# EasyEDA Pro project ProPrj_1300风扇_2024-07-27.epro

# Schematic Schematic1
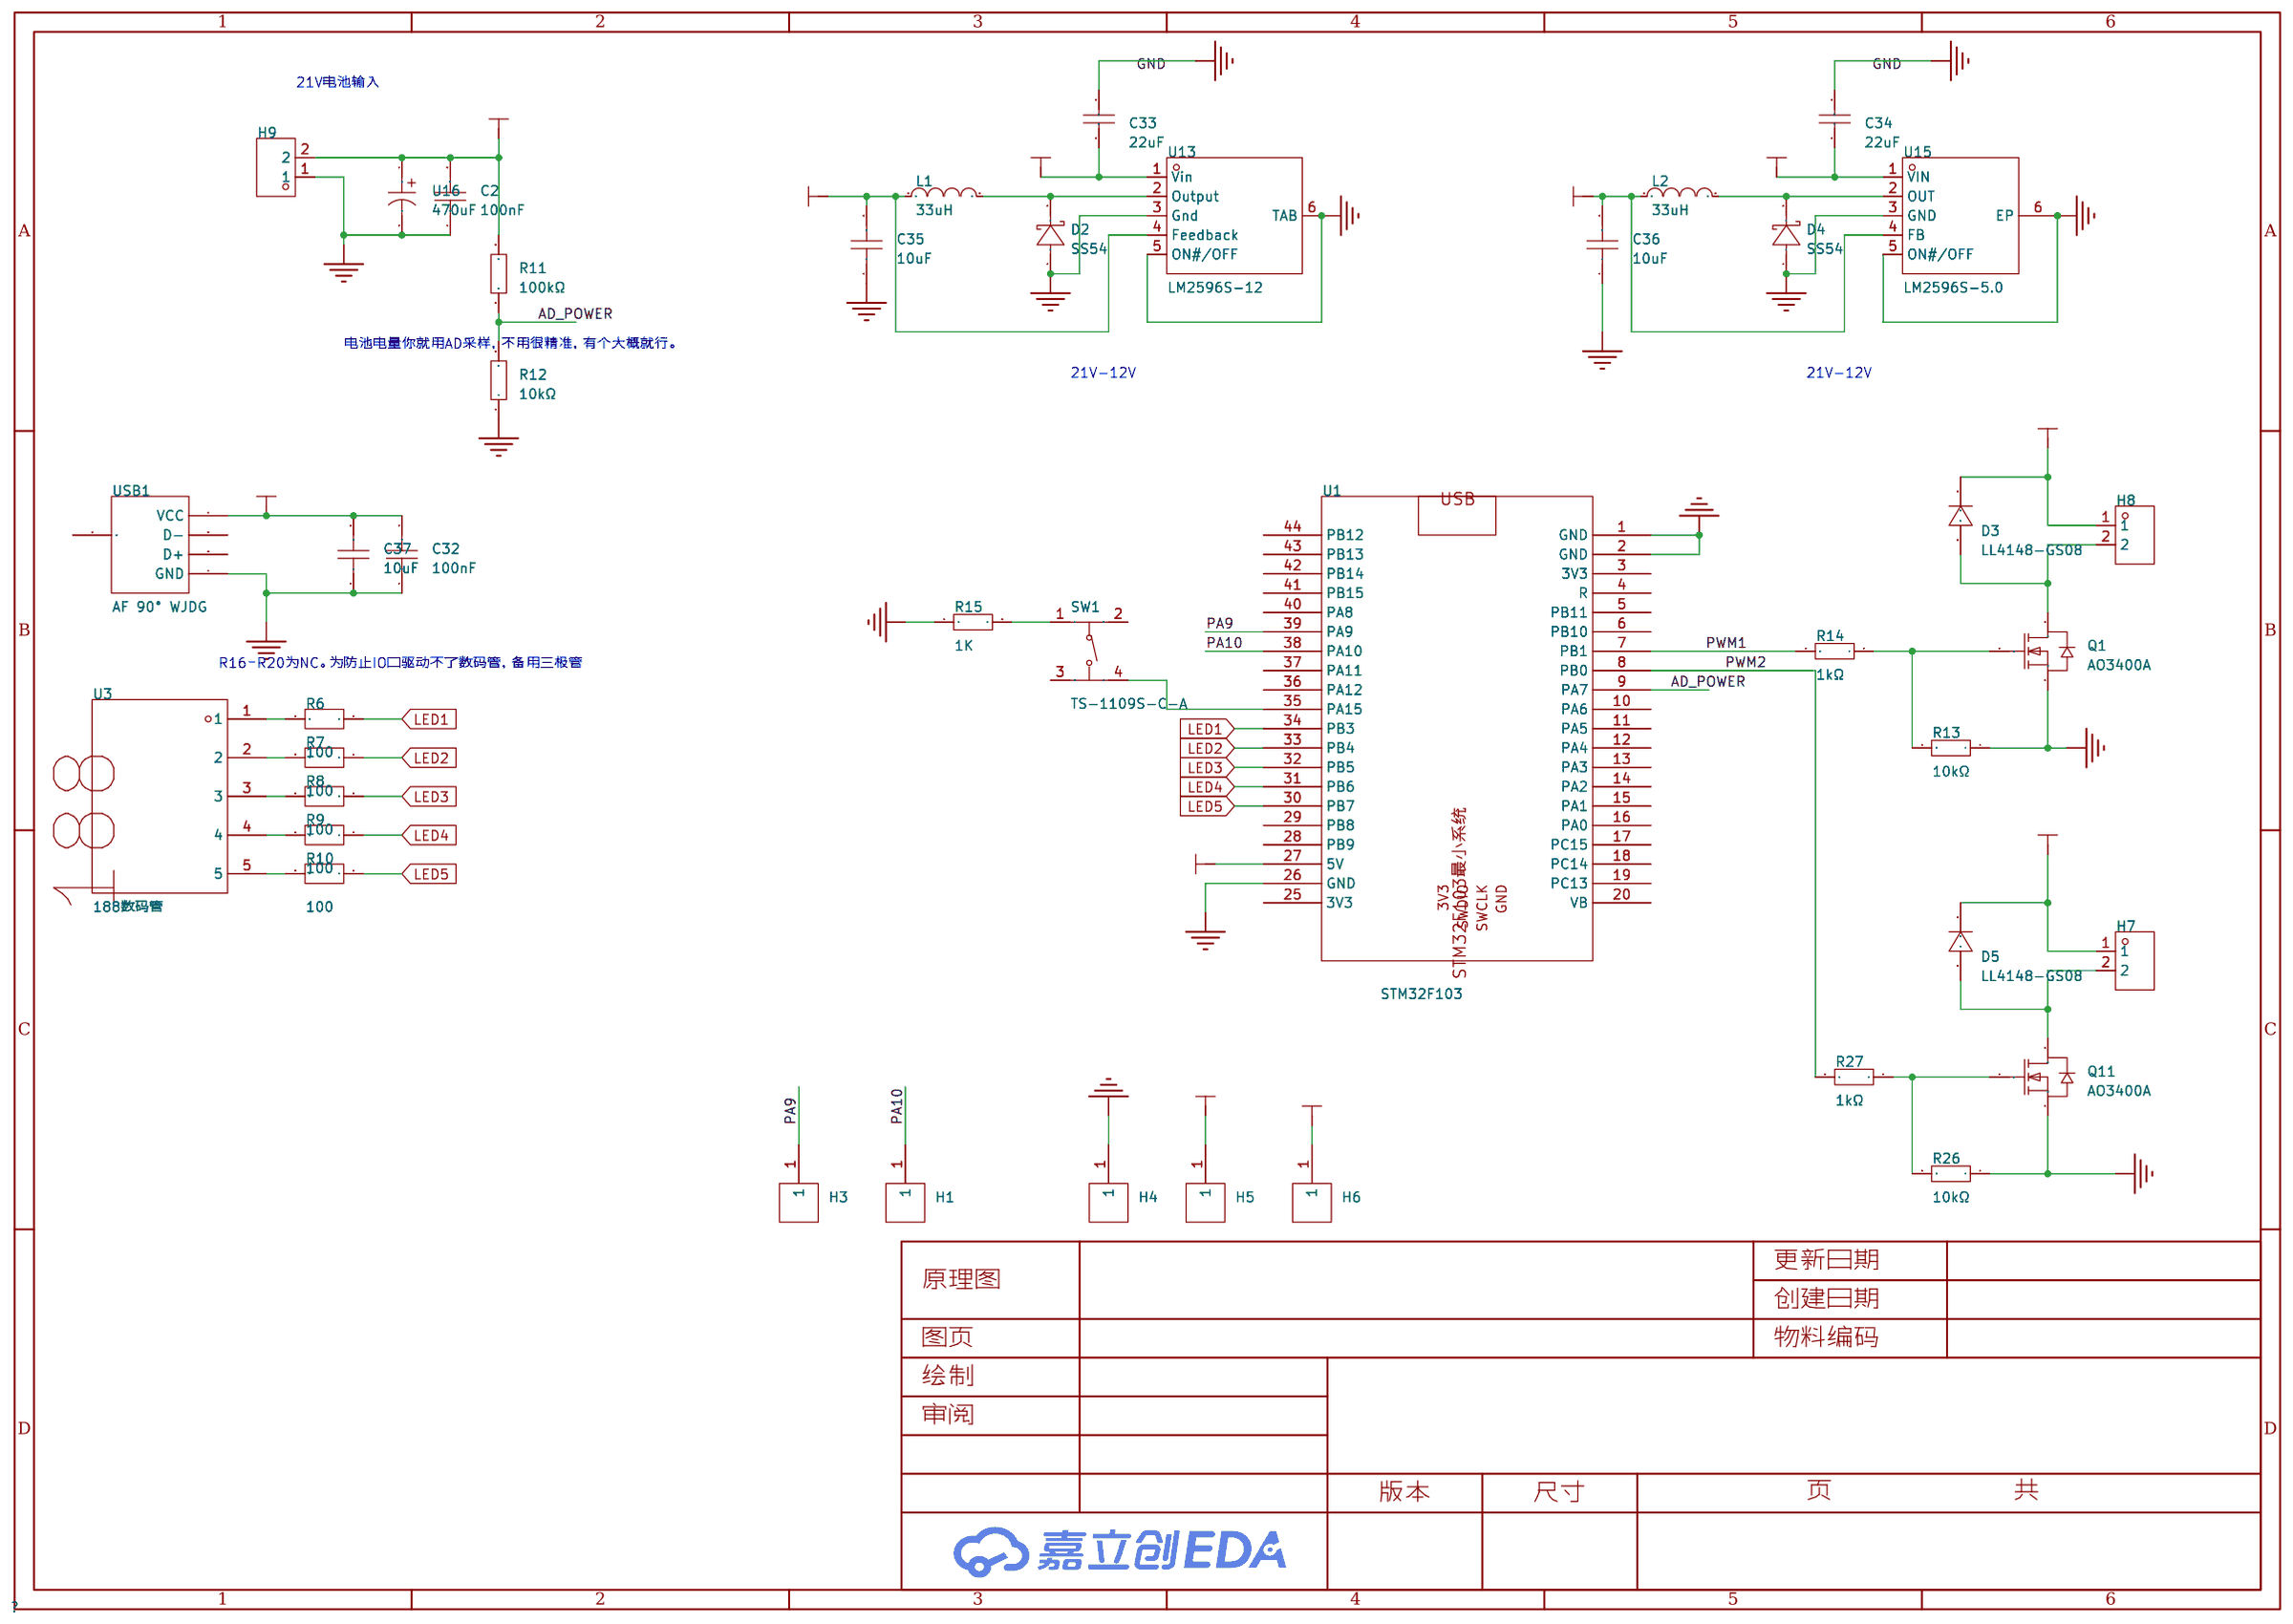
[diagram p0: schematic sheet]

## Parts
C2  100nF  [C0603]
C32  100nF  [C0603]
C33  22uF  [C1206]
C34  22uF  [C1206]
C35  10uF  [C0805]
C36  10uF  [C0805]
C37  10uF  [C0805]
D2  SS54  [SMA_L4.3-W2.6-LS5.0-FD]
D3  LL4148-GS08  [SOD-80_L3.5-W1.5-RD]
D4  SS54  [SMA_L4.3-W2.6-LS5.0-FD]
D5  LL4148-GS08  [SOD-80_L3.5-W1.5-RD]
H1  PZ254V-11-01P  [HDR-TH_1P-P2.54-V-M]
H3  PZ254V-11-01P  [HDR-TH_1P-P2.54-V-M]
H4  PZ254V-11-01P  [HDR-TH_1P-P2.54-V-M]
H5  PZ254V-11-01P  [HDR-TH_1P-P2.54-V-M]
H6  PZ254V-11-01P  [HDR-TH_1P-P2.54-V-M]
H7  PZ254V-11-02P  [HDR-TH_2P-P2.54-V-M]
H8  PZ254V-11-02P  [HDR-TH_2P-P2.54-V-M]
H9  PZ254V-11-02P  [HDR-TH_2P-P2.54-V-M]
L1  33uH  [IND-SMD_L7.0-W6.6_FXL0630]
L2  33uH  [IND-SMD_L7.0-W6.6_FXL0630]
Q1  AO3400A  [SOT-23-3_L2.9-W1.6-P1.90-LS2.8-BR]
Q11  AO3400A  [SOT-23-3_L2.9-W1.6-P1.90-LS2.8-BR]
R6  100  [R0603]
R7  100  [R0603]
R8  100  [R0603]
R9  100  [R0603]
R10  100  [R0603]
R11  100kΩ  [R0603]
R12  10kΩ  [R0603]
R13  10kΩ  [R0603]
R14  1kΩ  [R0603]
R15  1K  [R0603]
R26  10kΩ  [R0603]
R27  1kΩ  [R0603]
SW1  TS-1109S-C-A  [SW-SMD_4P-L4.5-W4.5-P3.00-LS7.0]
U1  STM32F103  [STM32FF103]
U3  188数码管  [188数码管]  (no BOM)
U13  LM2596S-12  [TO-263-5_L10.0-W8.4-P1.70-LS15.3-BR]
U15  LM2596S-5.0  [TO-263-5_L10.2-W8.9-P1.70-BR]
U16  470uF  [CAP-TH_BD6.3-P2.50-D0.6-FD]
USB1  AF 90° WJDG  [USB-A-TH_AF-WJDG]

## Library data of the parts
C2 C32 = CC0603KRX7R9BB104: 容值:100nF;精度:±10%;额定电压:50V;材质(温度系数):X7R;; LCSC Part Name: 100nF ±10% 50V; Supplier Part: C14663; Manufacturer: YAGEO(国巨); Supplier Footprint: 0603; JLCPCB Part Class: 基础库; Datasheet: https://atta.szlcsc.com/upload/public/pdf/source/20180910/C282072_33301C7F631E79921B82A8DAC6BCC5B3.pdf; Supplier: LCSC; Tolerance: ±10%; Voltage Rated: 50V; Temperature Coefficient: X7R
C33 C34 = CL31A226KAHNNNE: 容值:22uF;精度:±10%;额定电压:25V;材质(温度系数):X5R;; LCSC Part Name: 22uF ±10% 25V; Supplier Part: C12891; Manufacturer: SAMSUNG(三星); Supplier Footprint: 1206; JLCPCB Part Class: 基础库; Datasheet: https://atta.szlcsc.com/upload/public/pdf/source/20160218/1457707763339.pdf; Supplier: LCSC; Tolerance: ±10%; Voltage Rated: 25V; Temperature Coefficient: X5R
C35-C37 = CL21A106KAYNNNE_C15850: 容值:10uF;精度:±10%;额定电压:25V;材质(温度系数):X5R;; LCSC Part Name: 10uF ±10% 25V; Supplier Part: C15850; Manufacturer: SAMSUNG(三星); Manufacturer Part: CL21A106KAYNNNE; Supplier Footprint: 0805; JLCPCB Part Class: 基础库; Datasheet: https://atta.szlcsc.com/upload/public/pdf/source/20160218/1457707763339.pdf; Supplier: LCSC; Tolerance: ±10%; Voltage Rated: 25V; Temperature Coefficient: X5R
D2 D4 = SS54_C7420369: 二极管配置:独立式;正向压降(Vf):550mV@5.0A;直流反向耐压(Vr):40V;平均整流电流(Io):5A;; LCSC Part Name: 电压:40V 电流:5A; Supplier Part: C7420369; Manufacturer: 宏迦橙; Supplier Footprint: SMA(DO-214AC); JLCPCB Part Class: 扩展库; Datasheet: https://atta.szlcsc.com/upload/public/pdf/source/20230828/254C3882F8647358AD9F60DD73611B5E.pdf; Supplier: LCSC; Diode Configuration: 独立式; Forward Voltage (Vf@If): 550mV@5.0A; Reverse Voltage (Vr): 40V; Average Rectified Current (Io): 5A; Reverse Leakage Current (Ir): 50uA@40V; Peak forward surge current: 120A
D3 D5 = LL4148-GS08: 二极管配置:-;正向压降(Vf):860mV@50mA;直流反向耐压(Vr):75V;平均整流电流(Io):300mA;功率:500mW;反向恢复时间(trr):8ns;; LCSC Part Name: 电压:75V 电流:300mA; Supplier Part: C68883; Manufacturer: VISHAY(威世); Supplier Footprint: MiniMELF; JLCPCB Part Class: 扩展库; Datasheet: https://atta.szlcsc.com/upload/public/pdf/source/20160803/1470206543327.pdf; Supplier: LCSC; Forward Voltage (Vf@If): 860mV@50mA; Reverse Voltage (Vr): 75V; Average Rectified Current (Io): 300mA; Power Dissipation: 500mW; Reverse Leakage Current: 5uA@75V; Reverse Recovery Time (trr): 8ns
H1 H3-H6 = PZ254V-11-01P: 插针结构:1x1P;间距:2.54mm;行距:-;圆针/方针:方针;安装类型:直插;排数:单排;总PIN位数:1P;额定电流:-;额定电压:-;配合针长度:6mm;塑高:2.5mm;端接针长度:3mm;触头材质:黄铜;触头镀层:-;工作温度范围:-40℃~+105℃;颜色:黑色;; LCSC Part Name: 间距:2.54mm 1x1P 直插 方针; Supplier Part: C492400; Manufacturer: XFCN(兴飞); Supplier Footprint: 插件,P=2.54mm; JLCPCB Part Class: 扩展库; Datasheet: https://atta.szlcsc.com/upload/public/pdf/source/20200309/C492400_46876A5B545F5AE6B8D4A09C46E276E8.pdf; Supplier: LCSC; Pin Structure: 1x1P; Pitch: 2.54mm; Circluar Pins/Square Pins: 方针; Mounting Type: 直插; Number of Rows: 单排; Number of Pins: 1P; Length of Mating Pin: 6mm; Insulation Height: 2.5mm; Length of End Connection Pin: 3mm; Contact Material: 黄铜; Operating Temperature Range: -40℃~+105℃; Color: 黑色
H7-H9 = PZ254V-11-02P: 插针结构:1x2P;间距:2.54mm;行距:-;圆针/方针:方针;安装类型:直插;排数:单排;总PIN位数:2P;额定电流:-;额定电压:-;配合针长度:6mm;塑高:2.5mm;端接针长度:3mm;触头材质:黄铜;触头镀层:-;工作温度范围:-40℃~+105℃;颜色:黑色;; LCSC Part Name: 间距:2.54mm 1x2P 直插 方针; Supplier Part: C492401; Manufacturer: XFCN(兴飞); Supplier Footprint: 插件,P=2.54mm; JLCPCB Part Class: 扩展库; Datasheet: https://atta.szlcsc.com/upload/public/pdf/source/20200309/C492401_A812433581A9B211A7FFA413ADDFF0E5.pdf; Supplier: LCSC; Pin Structure: 1x2P; Pitch: 2.54mm; Circluar Pins/Square Pins: 方针; Mounting Type: 直插; Number of Rows: 单排; Number of Pins: 2P; Length of Mating Pin: 6mm; Insulation Height: 2.5mm; Length of End Connection Pin: 3mm; Contact Material: 黄铜; Operating Temperature Range: -40℃~+105℃; Color: 黑色
L1 L2 = FXL0630-330-M: 电感值:33uH;精度:±20%;额定电流:2A;饱和电流(Isat):2.5A;类型:一体成型电感;; LCSC Part Name: 33uH ±20% 2.5A; Supplier Part: C177245; Manufacturer: cjiang(长江微电); Supplier Footprint: SMD,6.6x7mm; JLCPCB Part Class: 扩展库; Datasheet: https://atta.szlcsc.com/upload/public/pdf/source/20230516/3A080F5AF8C87BB81C3BA86E5F60E51A.pdf; Supplier: LCSC; Tolerance: ±20%; Rated Current: 2A; Saturation Current (Isat): 2.5A; DC Resistance (DCR): 310mΩ; Type: 一体成型电感
Q1 Q11 = AO3400A_C20917: 类型:1个N沟道;漏源电压(Vdss):30V;连续漏极电流(Id):5.7A;功率(Pd):1.4W;导通电阻(RDS(on)@Vgs,Id):26.5mΩ@10V,5.7A;阈值电压(Vgs(th)@Id):1.5V@250uA;; LCSC Part Name: 1个N沟道 耐压:30V 电流:5.7A; Supplier Part: C20917; Manufacturer: AOS; Supplier Footprint: SOT-23-3L; JLCPCB Part Class: 基础库; Datasheet: https://atta.szlcsc.com/upload/public/pdf/source/20140107/1457706668533.pdf; Supplier: LCSC; Type: 1个N沟道; Drain Source Voltage (Vdss): 30V; Continuous Drain Current (Id): 5.7A; Power Dissipation (Pd): 1.4W; Drain Source On Resistance (RDS(on)@Vgs,Id): 26.5mΩ@10V,5.7A; Gate Threshold Voltage (Vgs(th)@Id): 1.5V@250uA; Total Gate Charge (Qg@Vgs): 7nC@4.5V; Input Capacitance (Ciss@Vds): 630pF@15V; Operating Temperature: -55℃~+150℃@(Tj)
R6-R10 = 100
R11 = RC0603FR-07100KL: 电阻类型:厚膜电阻;阻值:100kΩ;精度:±1%;功率:100mW;最大工作电压:75V;温度系数:±100ppm/℃;; LCSC Part Name: 厚膜电阻 100kΩ ±1% 100mW; Supplier Part: C14675; Manufacturer: YAGEO(国巨); Supplier Footprint: 0603; JLCPCB Part Class: 扩展库; Datasheet: https://atta.szlcsc.com/upload/public/pdf/source/20140324/1457707028752.pdf; Supplier: LCSC; Type: 厚膜电阻; Tolerance: ±1%; Power(Watts): 100mW; Overload Voltage (Max): 75V; Temperature Coefficient: ±100ppm/℃; Operating Temperature Range: -55℃~+155℃
R12 R13 R15 R26 = 0603WAF1002T5E: 电阻类型:厚膜电阻;阻值:10kΩ;精度:±1%;功率:100mW;最大工作电压:75V;温度系数:±100ppm/℃;; LCSC Part Name: 厚膜电阻 10kΩ ±1% 100mW; Supplier Part: C25804; Manufacturer: UNI-ROYAL(厚声); Supplier Footprint: 0603; JLCPCB Part Class: 基础库; Datasheet: https://atta.szlcsc.com/upload/public/pdf/source/20200306/C422600_1E6D84923E4A46A82E41ADD87F860B5C.pdf; Supplier: LCSC; Type: 厚膜电阻; Tolerance: ±1%; Power(Watts): 100mW; Overload Voltage (Max): 75V; Temperature Coefficient: ±100ppm/℃; Operating Temperature Range: -55℃~+155℃
R14 R27 = 0603WAF1001T5E: 电阻类型:厚膜电阻;阻值:1kΩ;精度:±1%;功率:100mW;最大工作电压:75V;温度系数:±100ppm/℃;; LCSC Part Name: 1kΩ ±1% 100mW 厚膜电阻; Supplier Part: C21190; Manufacturer: UNI-ROYAL(厚声); Supplier Footprint: 0603; JLCPCB Part Class: 基础库; Datasheet: https://atta.szlcsc.com/upload/public/pdf/source/20200306/C422600_1E6D84923E4A46A82E41ADD87F860B5C.pdf; Supplier: LCSC; Type: 厚膜电阻; Tolerance: ±1%; Power(Watts): 100mW; Overload Voltage (Max): 75V; Temperature Coefficient: ±100ppm/℃; Operating Temperature Range: -55℃~+155℃
SW1 = TS-1109S-C-A: 电路结构:单刀单掷;按钮形状:圆形按钮;作用力:260gf;安装方式:立贴;开关长度:4.5mm;开关宽度:4.5mm;开关高度:3.8mm;带支架:不带;触点电流:50mA;额定电压(DC):12V;绝缘电阻:-;带灯:无;机械寿命:10万次;; LCSC Part Name: 4.5*4.5*3.8mm 立贴 轻触开关; Supplier Part: C397346; Manufacturer: XKB Connectivity(中国星坤); Supplier Footprint: SMD; JLCPCB Part Class: 扩展库; Datasheet: https://atta.szlcsc.com/upload/public/pdf/source/20211011/CFAE96021CF3492A687EDA5E1FB4F9CF.pdf; Supplier: LCSC; Circuit: 单刀单掷; Actuator Style: 圆形按钮; Operating Force: 260gf; Mounting Style: 立贴; Switch Length: 4.5mm; Switch Width: 4.5mm; Switch Height: 3.8mm; Strike Gundam: 不带; Contact Current: 50mA; Voltage Rating (DC): 12V; Actuator/Cap Color: 黑色; With Lamp: 无; Mechanical Life: 10万次; Operating Temperature: -30℃~+85℃
U1 = STM32F103: Library Name: 自制原理图封装
U3 = 188数码管: link: https://item.taobao.com/item.htm?spm=a230r.1.14.30.334f1cb7MZebUt&amp;id=633499956474&amp;ns=1&amp;abbucket=12#detail
U13 = LM2596S-12_C347422: 功能类型:降压型;输出类型:固定;输入电压:40V;输出电压:12V;输出电流(最大值):3A;; Supplier Part: C347422; Manufacturer: UMW(友台半导体); Supplier Footprint: TO-263-5; JLCPCB Part Class: 扩展库; Datasheet: https://atta.szlcsc.com/upload/public/pdf/source/20230506/0930E65C3A8B7B120C8A4D8E5A8AC327.pdf; Supplier: LCSC; Function: 降压型; Output Type: 固定; Input Voltage: 40V; Output Voltage: 12V; Output Current (Max): 3A; Switching Frequency: 150kHz; Operating Temperature: -40℃~+125℃@(TA); Synchronous Rectification: 否; Number of Outputs: 1; Topology: 降压式; Switch tube (built-in/external): 内置
U15 = LM2596S-5.0_C347421: 功能类型:降压型;输出类型:固定;输入电压:40V;输出电压:5V;输出电流(最大值):3A;; Supplier Part: C347421; Manufacturer: UMW(友台半导体); Supplier Footprint: TO-263-5; JLCPCB Part Class: 扩展库; Datasheet: https://atta.szlcsc.com/upload/public/pdf/source/20230506/0930E65C3A8B7B120C8A4D8E5A8AC327.pdf; Supplier: LCSC; Function: 降压型; Output Type: 固定; Input Voltage: 40V; Output Voltage: 5V; Output Current (Max): 3A; Switching Frequency: 150kHz; Operating Temperature: -40℃~+125℃@(TA); Synchronous Rectification: 否; Number of Outputs: 1; Topology: 降压式; Switch tube (built-in/external): 内置
U16 = HT1E477M0611PC: 容值:470uF;精度:±20%;额定电压:25V;纹波电流:2.05A;等效串联电阻:35mΩ;; LCSC Part Name: 470uF ±20% 25V; Supplier Part: C5438695; Manufacturer: HONOR(荣誉); Supplier Footprint: 插件,D6.3xL11.5mm; JLCPCB Part Class: 扩展库; Datasheet: https://atta.szlcsc.com/upload/public/pdf/source/20230323/99CEEF301E75D54C6C0AC1BCAFD13AE7.pdf; Supplier: LCSC; Tolerance: ±20%; Rated Voltage: 25V; Ripple Current: 2.05A; Equivalent Series Resistance(ESR): 35mΩ; Lead Spacing: 2.5mm; φD: 6.3mm; L: 11.5mm; Lifetime @ Temp: 2000hrs@125℃; Operating Temperature: -55℃~+125℃
USB1 = AF 90° WJDG: 连接器类型:Type-A;标准:USB 2.0;公母:母;端口数量:1;触点数量:4P;安装方式:弯插;额定电流 - 电源:1.5A;工作温度范围:-25℃~+85℃;; LCSC Part Name: Type-A 母 弯插; Supplier Part: C456018; Manufacturer: SHOU HAN(首韩); Supplier Footprint: 插件; JLCPCB Part Class: 扩展库; Datasheet: https://atta.szlcsc.com/upload/public/pdf/source/20191113/C456018_B104E062BEB8E11E57E63560E04EE13A.pdf; Supplier: LCSC; Connector Type: Type-A; Standard: USB 2.0; Gender: 母; Number of Ports: 1; Number of Contacts: 4P; Mounting Style: 弯插; Current Rating - Power (Max): 1.5A; Operating Temperature Range: -25℃~+85℃

## Nets
12V: C34.1 C35.2 D3.1(C) D5.1(C) H6.1 H7.1 H8.1 L1.1 U13.4(Feedback) U15.1(VIN)
21V: C2.2 C33.1 H9.2 R11.2 U13.1(Vin) U16.1
+5V: C32.2 C36.2 C37.2 H5.1 L2.1 U1.27(5V) U15.4(FB) USB1.1(VCC)
GND: C2.1 C32.1 C33.2 C34.2 C35.1 C36.1 C37.1 D2.1(A) D4.1(A) H4.1 H9.1 Q1.2(S) Q11.2(S) R12.1 R13.1 R15.1 R26.1 U1.1(GND) U1.2(GND) U1.26(GND) U13.3(Gnd) U13.5(ON#/OFF) U13.6(TAB) U15.3(GND) U15.5(ON#/OFF) U15.6(EP) U16.2 USB1.4(GND)
AD_POWER: R11.1 R12.2 U1.9(PA7)
LED1: R6.1 U1.34(PB3)
LED2: R7.1 U1.33(PB4)
LED3: R8.1 U1.32(PB5)
LED4: R9.1 U1.31(PB6)
LED5: R10.1 U1.30(PB7)
PA9: H3.1 U1.39(PA9)
PA10: H1.1 U1.38(PA10)
PWM1: R14.2 U1.7(PB1)
PWM2: R27.2 U1.8(PB0)
$1N415: R10.2 U3.5
$1N416: R9.2 U3.4
$1N417: R8.2 U3.3
$1N418: R7.2 U3.2
$1N419: R6.2 U3.1
$1N1369: D2.2(K) L1.2 U13.2(Output)
$1N1904: Q1.1(G) R13.2 R14.1
$1N2035: D3.2(A) H8.2 Q1.3(D)
$1N3039: SW1.4 U1.35(PA15)
$1N3099: R15.2 SW1.1
$1N4412: D4.2(K) L2.2 U15.2(OUT)
$1N9058: Q11.1(G) R26.2 R27.1
$1N9059: D5.2(A) H7.2 Q11.3(D)

Not connected (* = marked no-connect by the designer): SW1 2 3; U1 3(3V3) 4(R) 5(PB11) 6(PB10) 10(PA6) 11(PA5) 12(PA4) 13(PA3) 14(PA2) 15(PA1) 16(PA0) 17(PC15) 18(PC14) 19(PC13) 20(VB) 25(3V3) 28(PB9) 29(PB8) 36(PA12) 37(PA11) 40(PA8) 41(PB15) 42(PB14) 43(PB13) 44(PB12); USB1 2(D-) 3(D+) 5(SHLD)

## Notes on the sheet
- 21V电池输入
- 电池电量你就用AD采样，不用很精准，有个大概就行。
- 21V-12V
- 21V-12V
- R16－R20为NC。为防止IO口驱动不了数码管，备用三极管

# Board PCB1
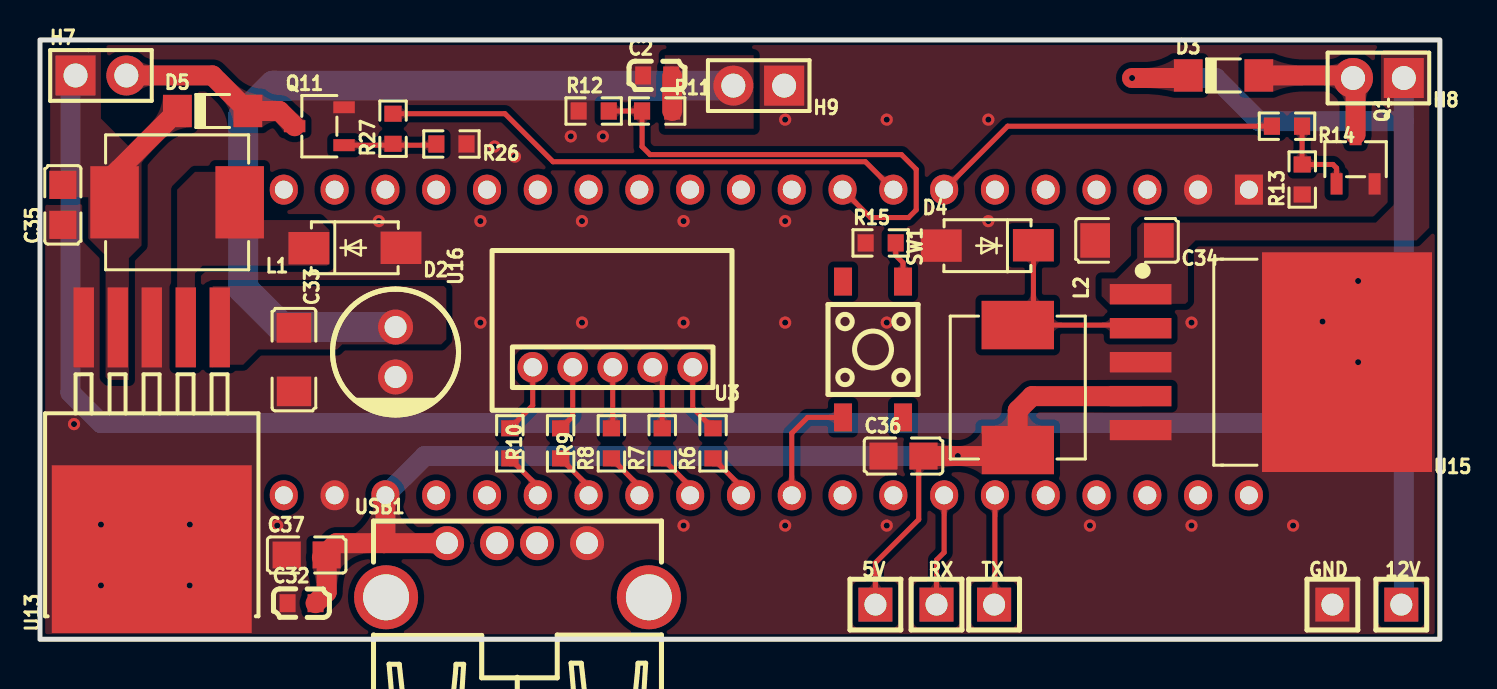
[diagram p1: board, top side]
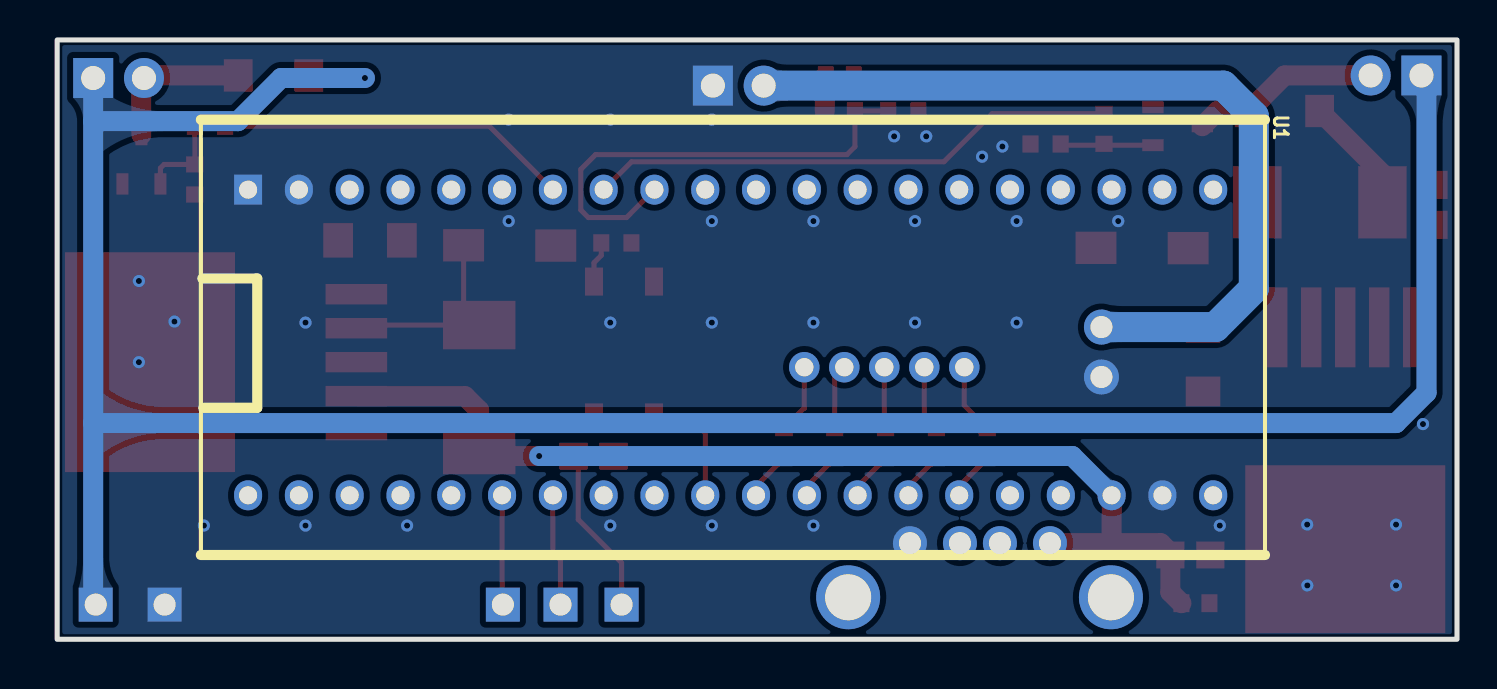
[diagram p2: board, bottom side, seen from below]

Outline 70 x 30 mm; copper layers: Top Layer, Bottom Layer. Coordinates in mm from the lower left corner of the outline.
Outline path: rectangle 0,30 70,0
Stack: Top Layer 0.035mm / Dielectric1 1.51mm FR4 er 4.5 / Bottom Layer 0.035mm

## Design rules (mm)
template: 自定义配置
spacing copperThickness1oz (default): track to track 0.102, other pairs 0.152 to 0.3
spacing copperThickness2oz: track to track 0.203, other pairs 0.152 to 0.3
track width copperThickness1oz (default): min 0.127, default 0.254, max 2.54
track width copperThickness2oz: min 0.203, default 0.254, max 2.54
differential pair differentialPair (default): width min 0.127, default 0.254, max 2.54; gap min 0.152, default 0.152
via viaSize (default): diameter min 0.5, default 0.61, max 10; hole min 0.3, default 0.305, max 6.3

## Placement (name value [footprint] x y rotation side)
5V  PZ254V-11-01P  [HDR-TH_1P-P2.54-V-M]  41.78 1.74 180 top
12V  PZ254V-11-01P  [HDR-TH_1P-P2.54-V-M]  68.07 1.74 180 top
C2  100nF  [C0603]  30.86 28.22 0 top
C32  100nF  [C0603]  13.08 1.81 0 top
C33  22uF  [C1206]  12.7 14 270 top
C34  22uF  [C1206]  54.36 19.97 180 top
C35  10uF  [C0805]  1.14 21.75 90 top
C36  10uF  [C0805]  43.18 9.17 0 top
C37  10uF  [C0805]  13.33 4.22 0 top
D2  SS54  [SMA_L4.3-W2.6-LS5.0-FD]  15.75 19.59 180 top
D3  LL4148-GS08  [SOD-80_L3.5-W1.5-RD]  59.18 28.22 0 top
D4  SS54  [SMA_L4.3-W2.6-LS5.0-FD]  47.37 19.71 0 top
D5  LL4148-GS08  [SOD-80_L3.5-W1.5-RD]  8.64 26.44 0 top
GND  PZ254V-11-01P  [HDR-TH_1P-P2.54-V-M]  64.63 1.74 180 top
H7  PZ254V-11-02P  [HDR-TH_2P-P2.54-V-M]  3.05 28.22 0 top
H8  PZ254V-11-02P  [HDR-TH_2P-P2.54-V-M]  66.93 28.09 180 top
H9  PZ254V-11-02P  [HDR-TH_2P-P2.54-V-M]  35.94 27.71 180 top
L1  33uH  [IND-SMD_L7.0-W6.6_FXL0630]  6.86 21.87 180 top
L2  33uH  [IND-SMD_L7.0-W6.6_FXL0630]  48.9 12.6 270 top
Q1  AO3400A  [SOT-23-3_L2.9-W1.6-P1.90-LS2.8-BR]  65.79 24.03 270 top
Q11  AO3400A  [SOT-23-3_L2.9-W1.6-P1.90-LS2.8-BR]  13.97 25.68 0 top
R6  100  [R0603]  33.66 9.81 90 top
R7  100  [R0603]  31.12 9.81 90 top
R8  100  [R0603]  28.57 9.81 90 top
R9  100  [R0603]  26.03 9.81 90 top
R10  100  [R0603]  23.5 9.81 90 top
R11  100kΩ  [R0603]  30.86 26.44 0 top
R12  10kΩ  [R0603]  27.69 26.44 0 top
R13  10kΩ  [R0603]  63.12 23.02 90 top
R14  1kΩ  [R0603]  62.36 25.68 180 top
R15  1K  [R0603]  42.04 19.84 0 top
R26  10kΩ  [R0603]  20.57 24.79 180 top
R27  1kΩ  [R0603]  17.65 25.56 90 top
RX  PZ254V-11-01P  [HDR-TH_1P-P2.54-V-M]  44.83 1.74 180 top
SW1  TS-1109S-C-A  [SW-SMD_4P-L4.5-W4.5-P3.00-LS7.0]  41.66 14.51 270 top
TX  PZ254V-11-01P  [HDR-TH_1P-P2.54-V-M]  47.71 1.74 180 top
U1  STM32F103  [STM32FF103]  60.45 22.51 270 bottom
U3  -  [188数码管]  32.64 13.62 180 top
U13  LM2596S-12  [TO-263-5_L10.0-W8.4-P1.70-LS15.3-BR]  5.59 10.06 90 top
U15  LM2596S-5.0  [TO-263-5_L10.2-W8.9-P1.70-BR]  60.2 13.87 180 top
U16  470uF  [CAP-TH_BD6.3-P2.50-D0.6-FD]  17.78 14.38 270 top
USB1  AF 90° WJDG  [USB-A-TH_AF-WJDG]  23.88 3.46 0 top

## Footprints (pads in the part's own frame, mm; a bottom-side part is the same pattern mirrored in y, then rotated)
188数码管
  round 1.524 hole 0.914: 1(0,0) 2(2,0) 3(4,0) 4(6,0) 5(8,0)
C0603
  rect 0.8x0.9 smd: 1(-0.7,0) 2(0.7,0)
C0805
  rect 1.41x1.35 smd: 1(-1,0) 2(1,0)
C1206
  rect 1.485x1.728 smd: 1(-1.593,0) 2(1.593,0)
CAP-TH_BD6.3-P2.50-D0.6-FD
  round 1.75 hole 1.1: 1(-1.25,0) 2(1.25,0)
HDR-TH_1P-P2.54-V-M
  rect 1.7x1.7 hole 1.1: 1(0,0)
HDR-TH_2P-P2.54-V-M
  rect 2x2 hole 1.2: 1(-1.27,0)
  round 2 hole 1.2: 2(1.27,0)
IND-SMD_L7.0-W6.6_FXL0630
  rect 2.424x3.62 smd: 1(3.128,0) 2(-3.128,0)
R0603
  rect 0.806x0.864 smd: 1(-0.753,0) 2(0.753,0)
SMA_L4.3-W2.6-LS5.0-FD
  rect 2.046x1.62 smd: 1(-2.304,-0.009) 2(2.304,0.009)
SOD-80_L3.5-W1.5-RD
  rect 1.44x1.62 smd: 1(-1.765,0) 2(1.765,0)
SOT-23-3_L2.9-W1.6-P1.90-LS2.8-BR
  rect 1.07x0.6 smd: 1(1.235,-0.95) 2(1.235,0.95) 3(-1.235,0)
STM32FF103
  rect 1.5x1.4 hole 0.9: 1(0,0)
  oval 1.5x1.4 hole 0.9: 2(0,2.54) 3(0,5.08) 4(0,7.62) 5(0,10.16) 6(0,12.7) 7(0,15.24) 8(0,17.78) 9(0,20.32) 10(0,22.86) 11(0,25.4) 12(0,27.94) 13(0,30.48) 14(0,33.02) 15(0,35.56) 16(0,38.1) 17(0,40.64) 18(0,43.18) 19(0,45.72) 20(0,48.26) 25(15.3,48.26) 26(15.3,45.72) 27(15.3,43.18) 28(15.3,40.64) 29(15.3,38.1) 30(15.3,35.56) 31(15.3,33.02) 32(15.3,30.48) 33(15.3,27.94) 34(15.3,25.4) 35(15.3,22.86) 36(15.3,20.32) 37(15.3,17.78) 38(15.3,15.24) 39(15.3,12.7) 40(15.3,10.16) 41(15.3,7.62) 42(15.3,5.08) 43(15.3,2.54) 44(15.3,0)
SW-SMD_4P-L4.5-W4.5-P3.00-LS7.0
  rect 1.4x0.9 smd: 1(-3.4,1.5) 2(3.4,1.5) 3(-3.4,-1.5) 4(3.4,-1.5)
TO-263-5_L10.0-W8.4-P1.70-LS15.3-BR
  rect 4x1.02 smd: 1(5.55,-3.4) 2(5.55,-1.7) 3(5.55,0) 4(5.55,1.7) 5(5.55,3.4)
  rect 8.4x10 smd: 6(-5.55,0)
TO-263-5_L10.2-W8.9-P1.70-BR
  rect 3.083x1.02 smd: 1(5.16,-3.4) 2(5.16,-1.7) 3(5.16,0) 4(5.16,1.7) 5(5.16,3.4)
  rect 8.5x11 smd: 6(-5.16,0)
USB-A-TH_AF-WJDG
  round 1.7 hole 1.1: 1(-3.521,1.355) 2(-1.018,1.355) 3(0.981,1.355) 4(3.48,1.355)
  round 3.2 hole 2.3: 5(-6.57,-1.355) 5(6.57,-1.355)

## Nets
As in the schematic, except:
12V: 12V.1 C34.1 C35.2 D3.1 D5.1 H7.1 H8.1 L1.1 U13.4 U15.1
+5V: 5V.1 C32.2 C36.2 C37.2 L2.1 U1.27 U15.4 USB1.1
GND: C2.1 C32.1 C33.2 C34.2 C35.1 C36.1 C37.1 D2.1 D4.1 GND.1 H9.1 Q1.2 Q11.2 R12.1 R13.1 R15.1 R26.1 U1.1 U1.2 U1.26 U13.3 U13.5 U13.6 U15.3 U15.5 U15.6 U16.2 USB1.4
PA9: TX.1 U1.39
PA10: RX.1 U1.38

Pads without a net: SW1 2 3; U1 3 4 5 6 10 11 12 13 14 15 16 17 18 19 20 25 28 29 36 37 40 41 42 43 44; USB1 2 3 5

## Via types
v1: diameter 0.61, hole 0.305, Top Layer to Bottom Layer, 36 vias

## Routing (per net, layer and track width the routed paths; a pad name or vN(x,y) marks a point on that pad's centre or on a via; arc(x,y) is an arc through that point)
12V: length 132.9
  Top Layer w1: v1(54.61,28.09) 57.29,28.09 D3.1 ; D5.1 3.73,23.3 L1.1
  Bottom Layer w1: H7.1 1.52,27.97 1.52,12.35 3.05,10.82 68.2,10.82 ; 12V.1 68.2,1.86 68.2,10.82 ; 68.2,25.94 60.96,25.94 58.8,28.09 v1(54.61,28.09) ; 68.2,25.94 68.2,10.82 ; 68.2,25.94 H8.1
21V: length 43.9
  Top Layer w1: 31.61,28.17 R11.2
  Bottom Layer w1.5: H9.2 11.68,27.71 10.16,26.19 10.16,17.55 12.08,15.63 U16.1
+5V: length 62.8
  Top Layer w0.254: 5V.1 41.78,3.83 43.94,6 43.94,8.93 C36.2
  Top Layer w1: 17.2,4.81 14.82,4.81 14.1,4.09 ; 17.2,4.81 USB1.1 ; 17.2,4.81 17.27,4.88 U1.27 ; C36.2 v1(45.9,9.17) 48.59,9.17 L2.1 48.9,11.46 49.61,12.17 U15.4 ; C32.2 14.33,2.36 C37.2
  Bottom Layer w1: U1.27 19.24,9.17 v1(45.9,9.17)
GND:
  vias: v1(1.7,10.77) v1(3.05,5.74) v1(3.05,2.7) v1(7.48,2.7) v1(7.49,5.74) v1(11.86,5.69) v1(16.94,20.93) v1(22.02,20.93) v1(22.02,15.85) v1(22.73,24.67) v1(23.75,24.16) v1(26.54,25.17) v1(27.1,20.93) v1(27.1,15.85) v1(28.15,25.17) v1(32.18,20.93) v1(32.18,15.85) v1(32.18,5.69) v1(37.26,26.01) v1(37.26,20.93) v1(37.26,15.85) v1(37.26,5.69) v1(42.34,26.01) v1(42.34,15.85) v1(42.34,5.69) v1(47.42,26.01) v1(47.42,20.93) v1(52.5,5.69) v1(57.58,15.85) v1(57.58,5.69) v1(62.66,5.69) v1(64.13,15.9) v1(65.91,17.94) v1(65.91,13.87)
AD_POWER: length 24.1
  Top Layer w0.254: U1.9 41.53,21.11 43.43,21.11 43.81,21.49 43.81,23.52 43.08,24.26 30.5,24.26 30.11,24.66 R11.1 R12.2
LED1: length 2.4
  Top Layer w0.254: R6.1 35.05,7.66 U1.34
LED2: length 2.4
  Top Layer w0.254: R7.1 32.51,7.66 U1.33
LED3: length 2.4
  Top Layer w0.254: U1.32 29.97,7.66 R8.1
LED4: length 2.4
  Top Layer w0.254: R9.1 27.43,7.66 U1.31
LED5: length 2.4
  Top Layer w0.254: R10.1 24.89,7.66 U1.30
PA9: length 5.5
  Top Layer w0.254: U1.39 47.75,1.78 TX.1
PA10: length 5.6
  Top Layer w0.254: U1.38 45.21,4.35 44.83,3.97 RX.1
PWM1: length 17.7
  Top Layer w0.254: U1.7 48.39,25.68 R14.2
PWM2: length 26.6
  Top Layer w0.254: R27.2 23.25,26.31 25.65,23.9 41.28,23.9 U1.8
$1N415: length 3.5
  Top Layer w0.254: U3.5 24.64,11.7 R10.2
$1N416: length 3.3
  Top Layer w0.254: R9.2 26.64,11.16 U3.4
$1N417: length 3.1
  Top Layer w0.254: R8.2 28.64,10.62 U3.3
$1N418: length 3.3
  Top Layer w0.254: R7.2 31.12,13.14 U3.2
$1N419: length 3.5
  Top Layer w0.254: R6.2 32.64,11.58 U3.1
$1N1904: length 4.5
  Top Layer w0.254: Q1.1 64.84,23.58 64.65,23.77 R13.2 63.11,23.78 R14.1
$1N2035: length 7.6
  Top Layer w1: D3.2 65.53,28.22 H8.2 65.79,27.97 Q1.3
$1N3039: length 6
  Top Layer w0.254: SW1.4 38.38,11.11 37.59,10.31 U1.35
$1N3099: length 2.1
  Top Layer w0.254: R15.2 42.79,19.21 43.16,18.85 SW1.1
$1N4412: length 10.5
  Top Layer w0.254: D4.2 49.68,16.51 L2.2 54.88,15.73 U15.2
$1N9058: length 4.6
  Top Layer w0.254: Q11.1 19.76,24.73 R26.2
$1N9059: length 9.5
  Top Layer w1: Q11.3 11.97,26.44 D5.2 8.62,28.22 H7.2

## Copper pours and planes (outline as drawn; the poured copper is in the pictures)
12V on Top Layer: 53.09,29.49 69.47,29.49 69.47,16.79 53.09,16.79
12V on Top Layer: 0.51,29.49 5.08,29.49 5.08,12.98 0.51,12.98
21V on Top Layer: 31.24,29.24 35.69,29.24 35.69,25.56 31.24,25.56
21V on Top Layer: 8.64,17.68 20.32,17.68 20.32,13.62 8.64,13.62
GND on Top Layer: -3.05,32.03 73.03,32.03 73.03,-2.89 -3.05,-2.89
GND on Bottom Layer: -3.94,32.29 73.79,32.29 73.79,-2 -3.94,-2
$1N1369 on Top Layer: 6.86,23.4 14.48,23.4 14.48,13.62 6.86,13.62

Small or netless copper shapes (teardrops, artwork), in the pictures only: 69 on Top Layer, 8 on Bottom Layer
